# EAGLE schematic 2022年度回路班_新電源基板 (EAGLE 9.6.2)
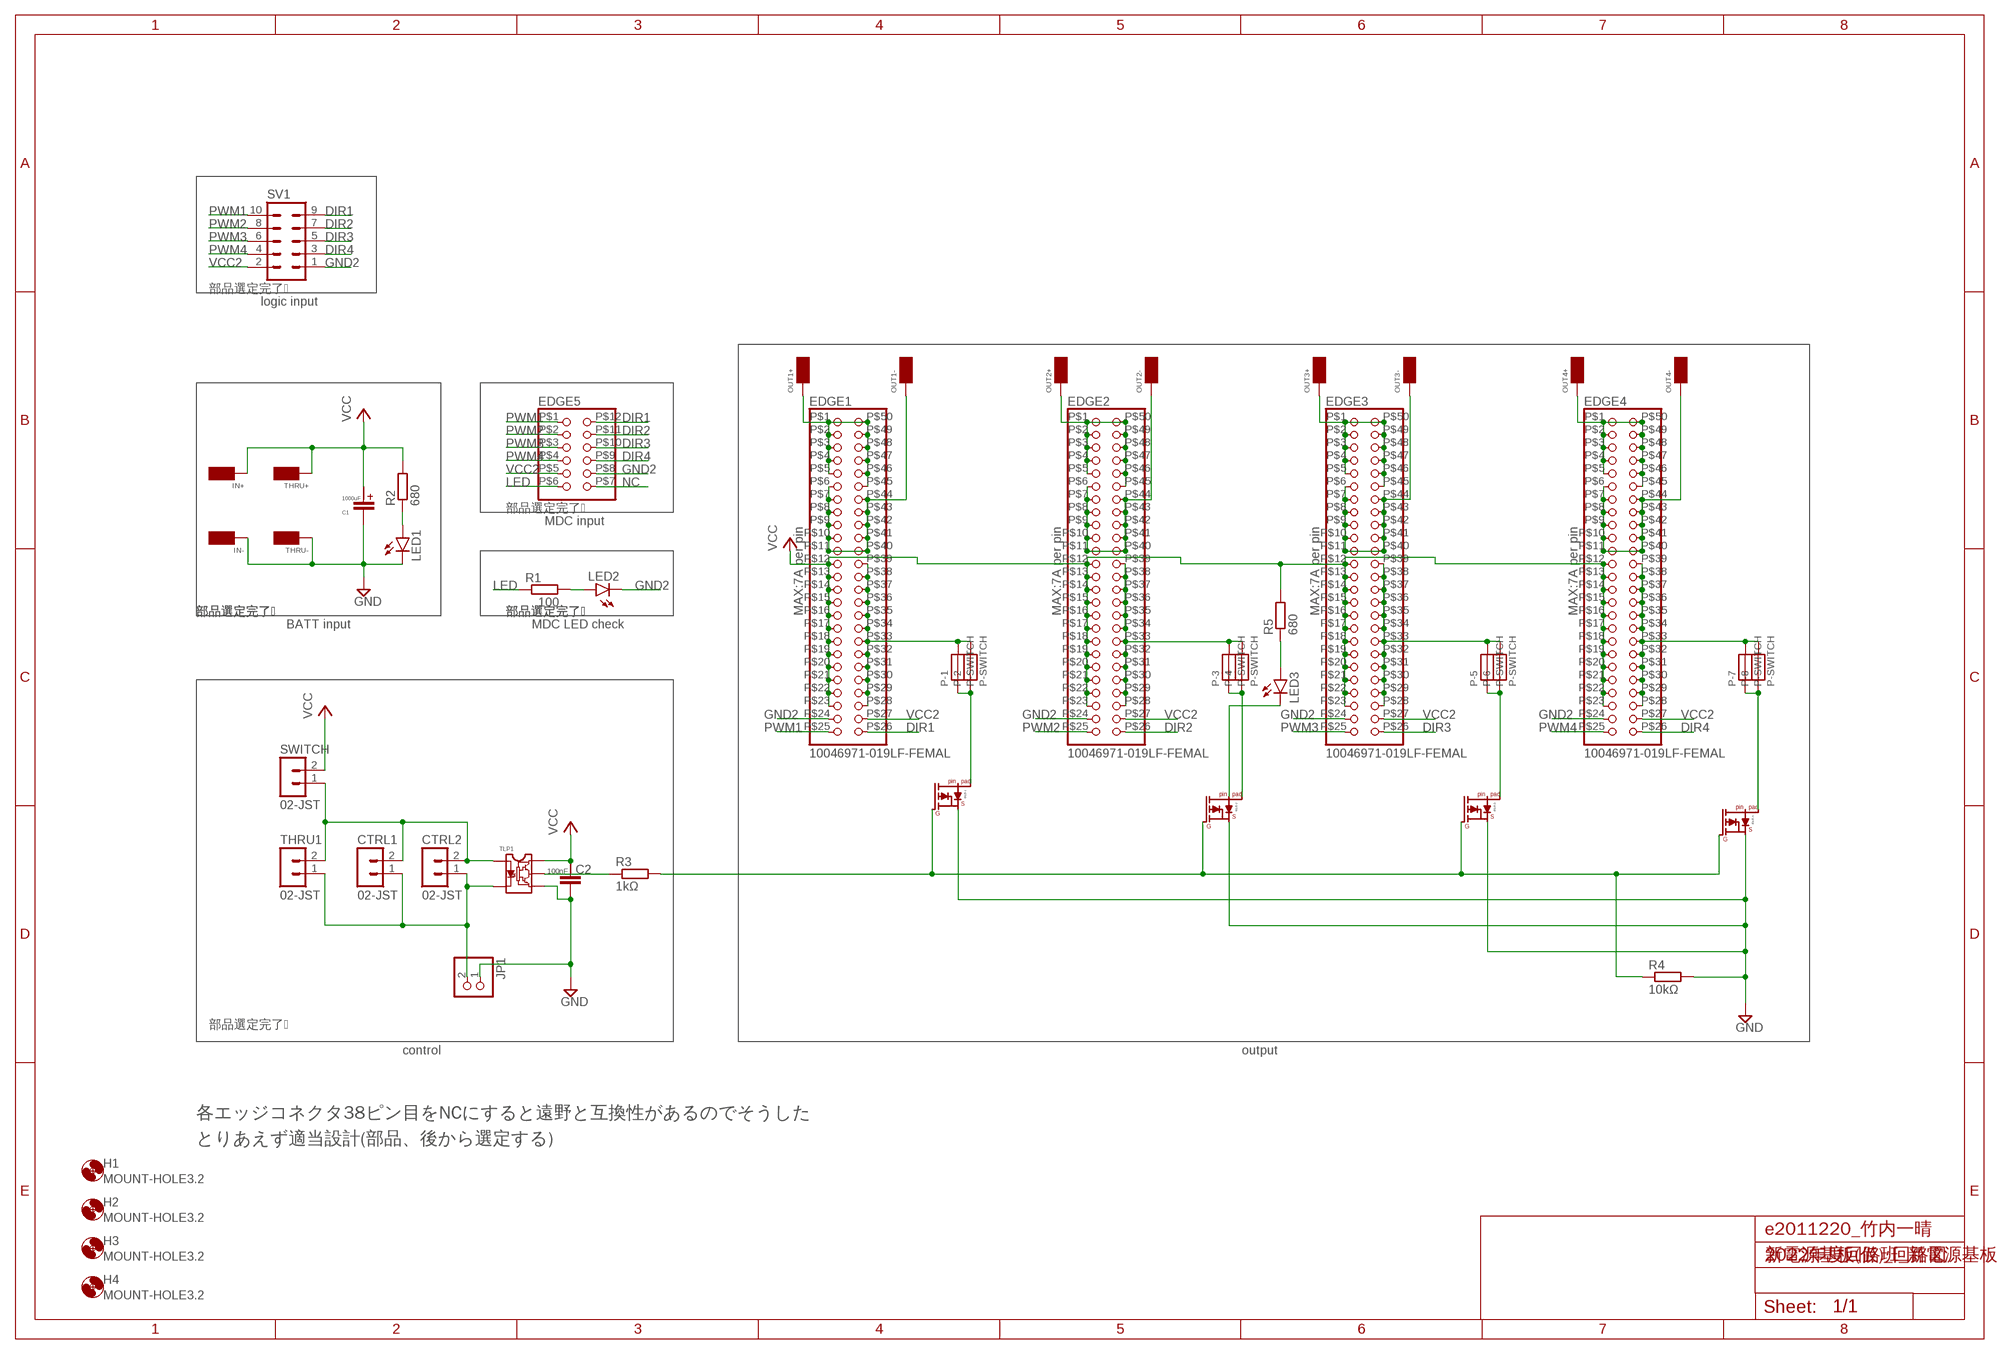
[diagram p0: schematic, sheet 1]

## Parts
C1  50ZLH1000MEFC16X25  [50ZLH1000MEFC16X25]
C2  GCM188L81H104KA57  [GCM188L81H104KA57]
CTRL1  02-JST  [B2B-XH]
CTRL2  02-JST  [B2B-XH]
EDGE1  10046971-019LF-FEMAL  [10046971-019LF]
EDGE2  10046971-019LF-FEMAL  [10046971-019LF]
EDGE3  10046971-019LF-FEMAL  [10046971-019LF]
EDGE4  10046971-019LF-FEMAL  [10046971-019LF]
EDGE5  7-5530843-6  [7-5530843-6]
H1  MOUNT-HOLE3.2  [3,2]
H2  MOUNT-HOLE3.2  [3,2]
H3  MOUNT-HOLE3.2  [3,2]
H4  MOUNT-HOLE3.2  [3,2]
IN+  PADS14  [AWG14]
IN-  PADS14  [AWG14]
IRLB-1  IRLB3813_2  [TO-220AB-PUT]
IRLB-2  IRLB3813_2  [TO-220AB-PUT]
IRLB-3  IRLB3813_2  [TO-220AB-PUT]
IRLB-4  IRLB3813_2  [TO-220AB-PUT]
JP1  PINHD-1X2  [1X02]
LED1  LED5MM  [LED5MM]
LED2  LED5MM  [LED5MM]
LED3  LED5MM  [LED5MM]
OUT1+  PADS14  [AWG14]
OUT1-  PADS14  [AWG14]
OUT2+  PADS14  [AWG14]
OUT2-  PADS14  [AWG14]
OUT3+  PADS14  [AWG14]
OUT3-  PADS14  [AWG14]
OUT4+  PADS14  [AWG14]
OUT4-  PADS14  [AWG14]
P-1  P-SWITCH  [P-SWITCH]
P-2  P-SWITCH  [P-SWITCH]
P-3  P-SWITCH  [P-SWITCH]
P-4  P-SWITCH  [P-SWITCH]
P-5  P-SWITCH  [P-SWITCH]
P-6  P-SWITCH  [P-SWITCH]
P-7  P-SWITCH  [P-SWITCH]
P-8  P-SWITCH  [P-SWITCH]
R1  100  R-EU_0204/7  [0204/7]
R2  680  R-EU_0204/7  [0204/7]
R3  1kΩ  R-EU_0204/7  [0204/7]
R4  10kΩ  R-EU_0204/7  [0204/7]
R5  680  R-EU_0204/7  [0204/7]
SV1  ML10  [ML10]
SWITCH  02-JST  [B2B-XH]
THRU1  02-JST  [B2B-XH]
THRU+  PADS14  [AWG14]
THRU-  PADS14  [AWG14]
TLP1  2227MC-08-03  [2227MC-08-03]

## Nets
DIR1: EDGE1.P$26(P26) EDGE5.P$12(P12) SV1.9
DIR2: EDGE2.P$26(P26) EDGE5.P$11(P11) SV1.7
DIR3: EDGE3.P$26(P26) EDGE5.P$10(P10) SV1.5
DIR4: EDGE4.P$26(P26) EDGE5.P$9(P9) SV1.3
GND: C1.C(CATHODE) C2.P$2 IN-.P$1 IRLB-1.S IRLB-2.S IRLB-3.S IRLB-4.S JP1.1 LED1.K(C) R4.2 THRU-.P$1 TLP1.P$5(GND)
GND2: EDGE1.P$24(P24) EDGE2.P$24(P24) EDGE3.P$24(P24) EDGE4.P$24(P24) EDGE5.P$8(P8) LED2.K(C) SV1.1
LED: EDGE5.P$6(P6) R1.1
N$1: EDGE1.P$6(P6) EDGE1.P$7(P7) EDGE1.P$8(P8) EDGE1.P$9(P9) EDGE1.P$10(P10) EDGE1.P$11(P11) EDGE1.P$40(P40) EDGE1.P$41(P41) EDGE1.P$42(P42) EDGE1.P$43(P43) EDGE1.P$44(P44) OUT1-.P$1
N$2: EDGE2.P$6(P6) EDGE2.P$7(P7) EDGE2.P$8(P8) EDGE2.P$9(P9) EDGE2.P$10(P10) EDGE2.P$11(P11) EDGE2.P$40(P40) EDGE2.P$41(P41) EDGE2.P$42(P42) EDGE2.P$43(P43) EDGE2.P$44(P44) OUT2-.P$1
N$3: LED3.A R5.1
N$4: EDGE1.P$1(P1) EDGE1.P$2(P2) EDGE1.P$3(P3) EDGE1.P$4(P4) EDGE1.P$5(P5) EDGE1.P$45(P45) EDGE1.P$46(P46) EDGE1.P$47(P47) EDGE1.P$48(P48) EDGE1.P$49(P49) EDGE1.P$50(P50) OUT1+.P$1
N$5: EDGE2.P$1(P1) EDGE2.P$2(P2) EDGE2.P$3(P3) EDGE2.P$4(P4) EDGE2.P$5(P5) EDGE2.P$45(P45) EDGE2.P$46(P46) EDGE2.P$47(P47) EDGE2.P$48(P48) EDGE2.P$49(P49) EDGE2.P$50(P50) OUT2+.P$1
N$6: EDGE3.P$1(P1) EDGE3.P$2(P2) EDGE3.P$3(P3) EDGE3.P$4(P4) EDGE3.P$5(P5) EDGE3.P$45(P45) EDGE3.P$46(P46) EDGE3.P$47(P47) EDGE3.P$48(P48) EDGE3.P$49(P49) EDGE3.P$50(P50) OUT3+.P$1
N$7: IRLB-1.P$1(PD) P-1.P$2 P-2.P$2
N$8: EDGE4.P$28(P28) EDGE4.P$29(P29) EDGE4.P$30(P30) EDGE4.P$31(P31) EDGE4.P$32(P32) EDGE4.P$33(P33) EDGE4.P$34(P34) EDGE4.P$35(P35) EDGE4.P$36(P36) EDGE4.P$37(P37) EDGE4.P$38(P38) EDGE4.P$39(P39) P-7.P$1 P-8.P$1
N$9: EDGE3.P$6(P6) EDGE3.P$7(P7) EDGE3.P$8(P8) EDGE3.P$9(P9) EDGE3.P$10(P10) EDGE3.P$11(P11) EDGE3.P$40(P40) EDGE3.P$41(P41) EDGE3.P$42(P42) EDGE3.P$43(P43) EDGE3.P$44(P44) OUT3-.P$1
N$10: EDGE4.P$1(P1) EDGE4.P$2(P2) EDGE4.P$3(P3) EDGE4.P$4(P4) EDGE4.P$5(P5) EDGE4.P$45(P45) EDGE4.P$46(P46) EDGE4.P$47(P47) EDGE4.P$48(P48) EDGE4.P$49(P49) EDGE4.P$50(P50) OUT4+.P$1
N$11: IRLB-2.P$1(PD) P-3.P$2 P-4.P$2
N$12: IRLB-4.P$1(PD) P-7.P$2 P-8.P$2
N$13: EDGE4.P$6(P6) EDGE4.P$7(P7) EDGE4.P$8(P8) EDGE4.P$9(P9) EDGE4.P$10(P10) EDGE4.P$11(P11) EDGE4.P$40(P40) EDGE4.P$41(P41) EDGE4.P$42(P42) EDGE4.P$43(P43) EDGE4.P$44(P44) OUT4-.P$1
N$14: EDGE3.P$28(P28) EDGE3.P$29(P29) EDGE3.P$30(P30) EDGE3.P$31(P31) EDGE3.P$32(P32) EDGE3.P$33(P33) EDGE3.P$34(P34) EDGE3.P$35(P35) EDGE3.P$36(P36) EDGE3.P$37(P37) EDGE3.P$38(P38) EDGE3.P$39(P39) P-5.P$1 P-6.P$1
N$15: IRLB-3.P$1(PD) P-5.P$2 P-6.P$2
N$17: LED1.A R2.1
N$18: LED2.A R1.2
N$19: CTRL1.2 CTRL2.2 SWITCH.1 THRU1.2 TLP1.P$2(ANODE)
N$20: R3.1 TLP1.P$6(VOUT)
N$21: CTRL1.1 CTRL2.1 JP1.2 THRU1.1 TLP1.P$3(CATHODE)
N$22: IRLB-1.G IRLB-2.G IRLB-3.G IRLB-4.G R3.2 R4.1
N$24: IRLB-2.D LED3.K(C)
N$25: EDGE1.P$28(P28) EDGE1.P$29(P29) EDGE1.P$30(P30) EDGE1.P$31(P31) EDGE1.P$32(P32) EDGE1.P$33(P33) EDGE1.P$34(P34) EDGE1.P$35(P35) EDGE1.P$36(P36) EDGE1.P$37(P37) EDGE1.P$38(P38) EDGE1.P$39(P39) P-1.P$1 P-2.P$1
N$26: EDGE2.P$28(P28) EDGE2.P$29(P29) EDGE2.P$30(P30) EDGE2.P$31(P31) EDGE2.P$32(P32) EDGE2.P$33(P33) EDGE2.P$34(P34) EDGE2.P$35(P35) EDGE2.P$36(P36) EDGE2.P$37(P37) EDGE2.P$38(P38) EDGE2.P$39(P39) P-3.P$1 P-4.P$1
NC: EDGE5.P$7(P7)
PWM1: EDGE1.P$25(P25) EDGE5.P$1(P1) SV1.10
PWM2: EDGE2.P$25(P25) EDGE5.P$2(P2) SV1.8
PWM3: EDGE3.P$25(P25) EDGE5.P$3(P3) SV1.6
PWM4: EDGE4.P$25(P25) EDGE5.P$4(P4) SV1.4
VCC: C1.A(ANODE) C2.P$1 EDGE1.P$12(P12) EDGE1.P$13(P13) EDGE1.P$14(P14) EDGE1.P$15(P15) EDGE1.P$16(P16) EDGE1.P$17(P17) EDGE1.P$18(P18) EDGE1.P$19(P19) EDGE1.P$20(P20) EDGE1.P$21(P21) EDGE1.P$22(P22) EDGE1.P$23(P23) EDGE2.P$12(P12) EDGE2.P$13(P13) EDGE2.P$14(P14) EDGE2.P$15(P15) EDGE2.P$16(P16) EDGE2.P$17(P17) EDGE2.P$18(P18) EDGE2.P$19(P19) EDGE2.P$20(P20) EDGE2.P$21(P21) EDGE2.P$22(P22) EDGE2.P$23(P23) EDGE3.P$12(P12) EDGE3.P$13(P13) EDGE3.P$14(P14) EDGE3.P$15(P15) EDGE3.P$16(P16) EDGE3.P$17(P17) EDGE3.P$18(P18) EDGE3.P$19(P19) EDGE3.P$20(P20) EDGE3.P$21(P21) EDGE3.P$22(P22) EDGE3.P$23(P23) EDGE4.P$12(P12) EDGE4.P$13(P13) EDGE4.P$14(P14) EDGE4.P$15(P15) EDGE4.P$16(P16) EDGE4.P$17(P17) EDGE4.P$18(P18) EDGE4.P$19(P19) EDGE4.P$20(P20) EDGE4.P$21(P21) EDGE4.P$22(P22) EDGE4.P$23(P23) IN+.P$1 R2.2 R5.2 SWITCH.2 THRU+.P$1 TLP1.P$8(VCC)
VCC2: EDGE1.P$27(P27) EDGE2.P$27(P27) EDGE3.P$27(P27) EDGE4.P$27(P27) EDGE5.P$5(P5) SV1.2
Unconnected: IRLB-1.D IRLB-3.D IRLB-4.D

## Notes on the sheet
- 部品選定完了☑
- logic input
- 部品選定完了☑
- MDC input
- 部品選定完了☑ | 部品選定完了☑ | 部品選定完了☑ | 部品選定完了☑
- BATT input | MDC LED check
- 部品選定完了☑
- control | output
- 各エッジコネクタ38ピン目をNCにすると遠野と互換性があるのでそうした
- とりあえず適当設計(部品、後から選定する)
- e2011220_竹内一晴
- 新電源基板(仮)_回路図

## Library data of the parts
C1 = 50ZLH1000MEFC16X25(1000uF):50ZLH1000MEFC16X25
C2 = GCM188L81H104K57(0.1uF):GCM188L81H104KA57
CTRL1 CTRL2 SWITCH THRU1 = con-jst-xh:02-JST: JST CONNECTOR
EDGE1-EDGE4 = 10046971-019LF-FEMAL:10046971-019LF-FEMAL
EDGE5 = 7-5530843-6:7-5530843-6
H1-H4 = holes:MOUNT-HOLE: MOUNTING HOLE with drill center marker
IN+ IN- OUT1+ OUT1- OUT2+ OUT2- OUT3+ OUT3- OUT4+ OUT4- THRU+ THRU- = OKUDA_libraries:PADS
IRLB-1-IRLB-4 = OKUDA_libraries:IRLB3813_2
JP1 = pinhead:PINHD-1X2: PIN HEADER
LED1-LED3 = led:LED: LED OSRAM: - CHIPLED LG R971, LG N971, LY N971, LG Q971, LY Q971, LO R971, LY R971 LH N974, LH R974 LS Q976, LO Q976, LY Q976 LO Q996 - Hyper CHIPLED LW Q18S LB Q993, LB Q99A, LB R99A - SideLED LS A670, LO A670, LY A670, LG A670, LP A670 LB A673, LV A673, LT A673, LW A673 LH A674 LY A675 LS A676, LA A676, LO A676, LY A676, LW A676 LS A679, LY A679, LG A679 - Hyper Micro SIDELED® LS Y876, LA Y876, LO Y876, LY Y876 LT Y87S - SmartLED LW L88C, LW L88S LB L89C, LB L89S, LG L890 LS L89K, LO L89K, LY L89K LS L896, LA L896, LO L896, LY L896 - TOPLED LS T670, LO T670, LY T670, LG T670, LP T670 LSG T670, LSP T670, LSY T670, LOP T670, LYG T670 LG T671, LOG T671, LSG T671 LB T673, LV T673, LT T673, LW T673 LH T674 LS T676, LA T676, LO T676, LY T676, LB T676, LH T676, LSB T676, LW T676 LB T67C, LV T67C, LT T67C, LS T67K, LO T67K, LY T67K, LW E67C LS E67B, LA E67B, LO E67B, LY E67B, LB E67C, LV E67C, LT E67C LW T67C LS T679, LY T679, LG T679 LS T770, LO T770, LY T770, LG T770, LP T770 LB T773, LV T773, LT T773, LW T773 LH T774 LS E675, LA E675, LY E675, LS T675 LS T776, LA T776, LO T776, LY T776, LB T776 LHGB T686 LT T68C, LB T68C - Hyper Mini TOPLED® LB M676 - Mini TOPLED Santana® LG M470 LS M47K, LO M47K, LY M47K Source: http://www.osram.convergy.de LUXEON: - LUMILED® LXK2-PW12-R00, LXK2-PW12-S00, LXK2-PW14-U00, LXK2-PW14-V00 LXK2-PM12-R00, LXK2-PM12-S00, LXK2-PM14-U00 LXK2-PE12-Q00, LXK2-PE12-R00, LXK2-PE12-S00, LXK2-PE14-T00, LXK2-PE14-U00 LXK2-PB12-K00, LXK2-PB12-L00, LXK2-PB12-M00, LXK2-PB14-N00, LXK2-PB14-P00, LXK2-PB14-Q00 LXK2-PR12-L00, LXK2-PR12-M00, LXK2-PR14-Q00, LXK2-PR14-R00 LXK2-PD12-Q00, LXK2-PD12-R00, LXK2-PD12-S00 LXK2-PH12-R00, LXK2-PH12-S00 LXK2-PL12-P00, LXK2-PL12-Q00, LXK2-PL12-R00 Source: www.luxeon.com KINGBRIGHT: KA-3528ASYC Source: www.kingbright.com
P-1-P-8 = OKUDA_libraries:P-SWITCH
R1-R5 = rcl:R-EU_: RESISTOR, European symbol; SPICEPREFIX: R
SV1 = con-ml:ML10: HARTING; OC_FARNELL: unknown; OC_NEWARK: unknown
TLP1 = TLP250H:2227MC-08-03